# EAGLE schematic NBMC_SCHEMATIC_wout_709 (EAGLE 6.6.0)
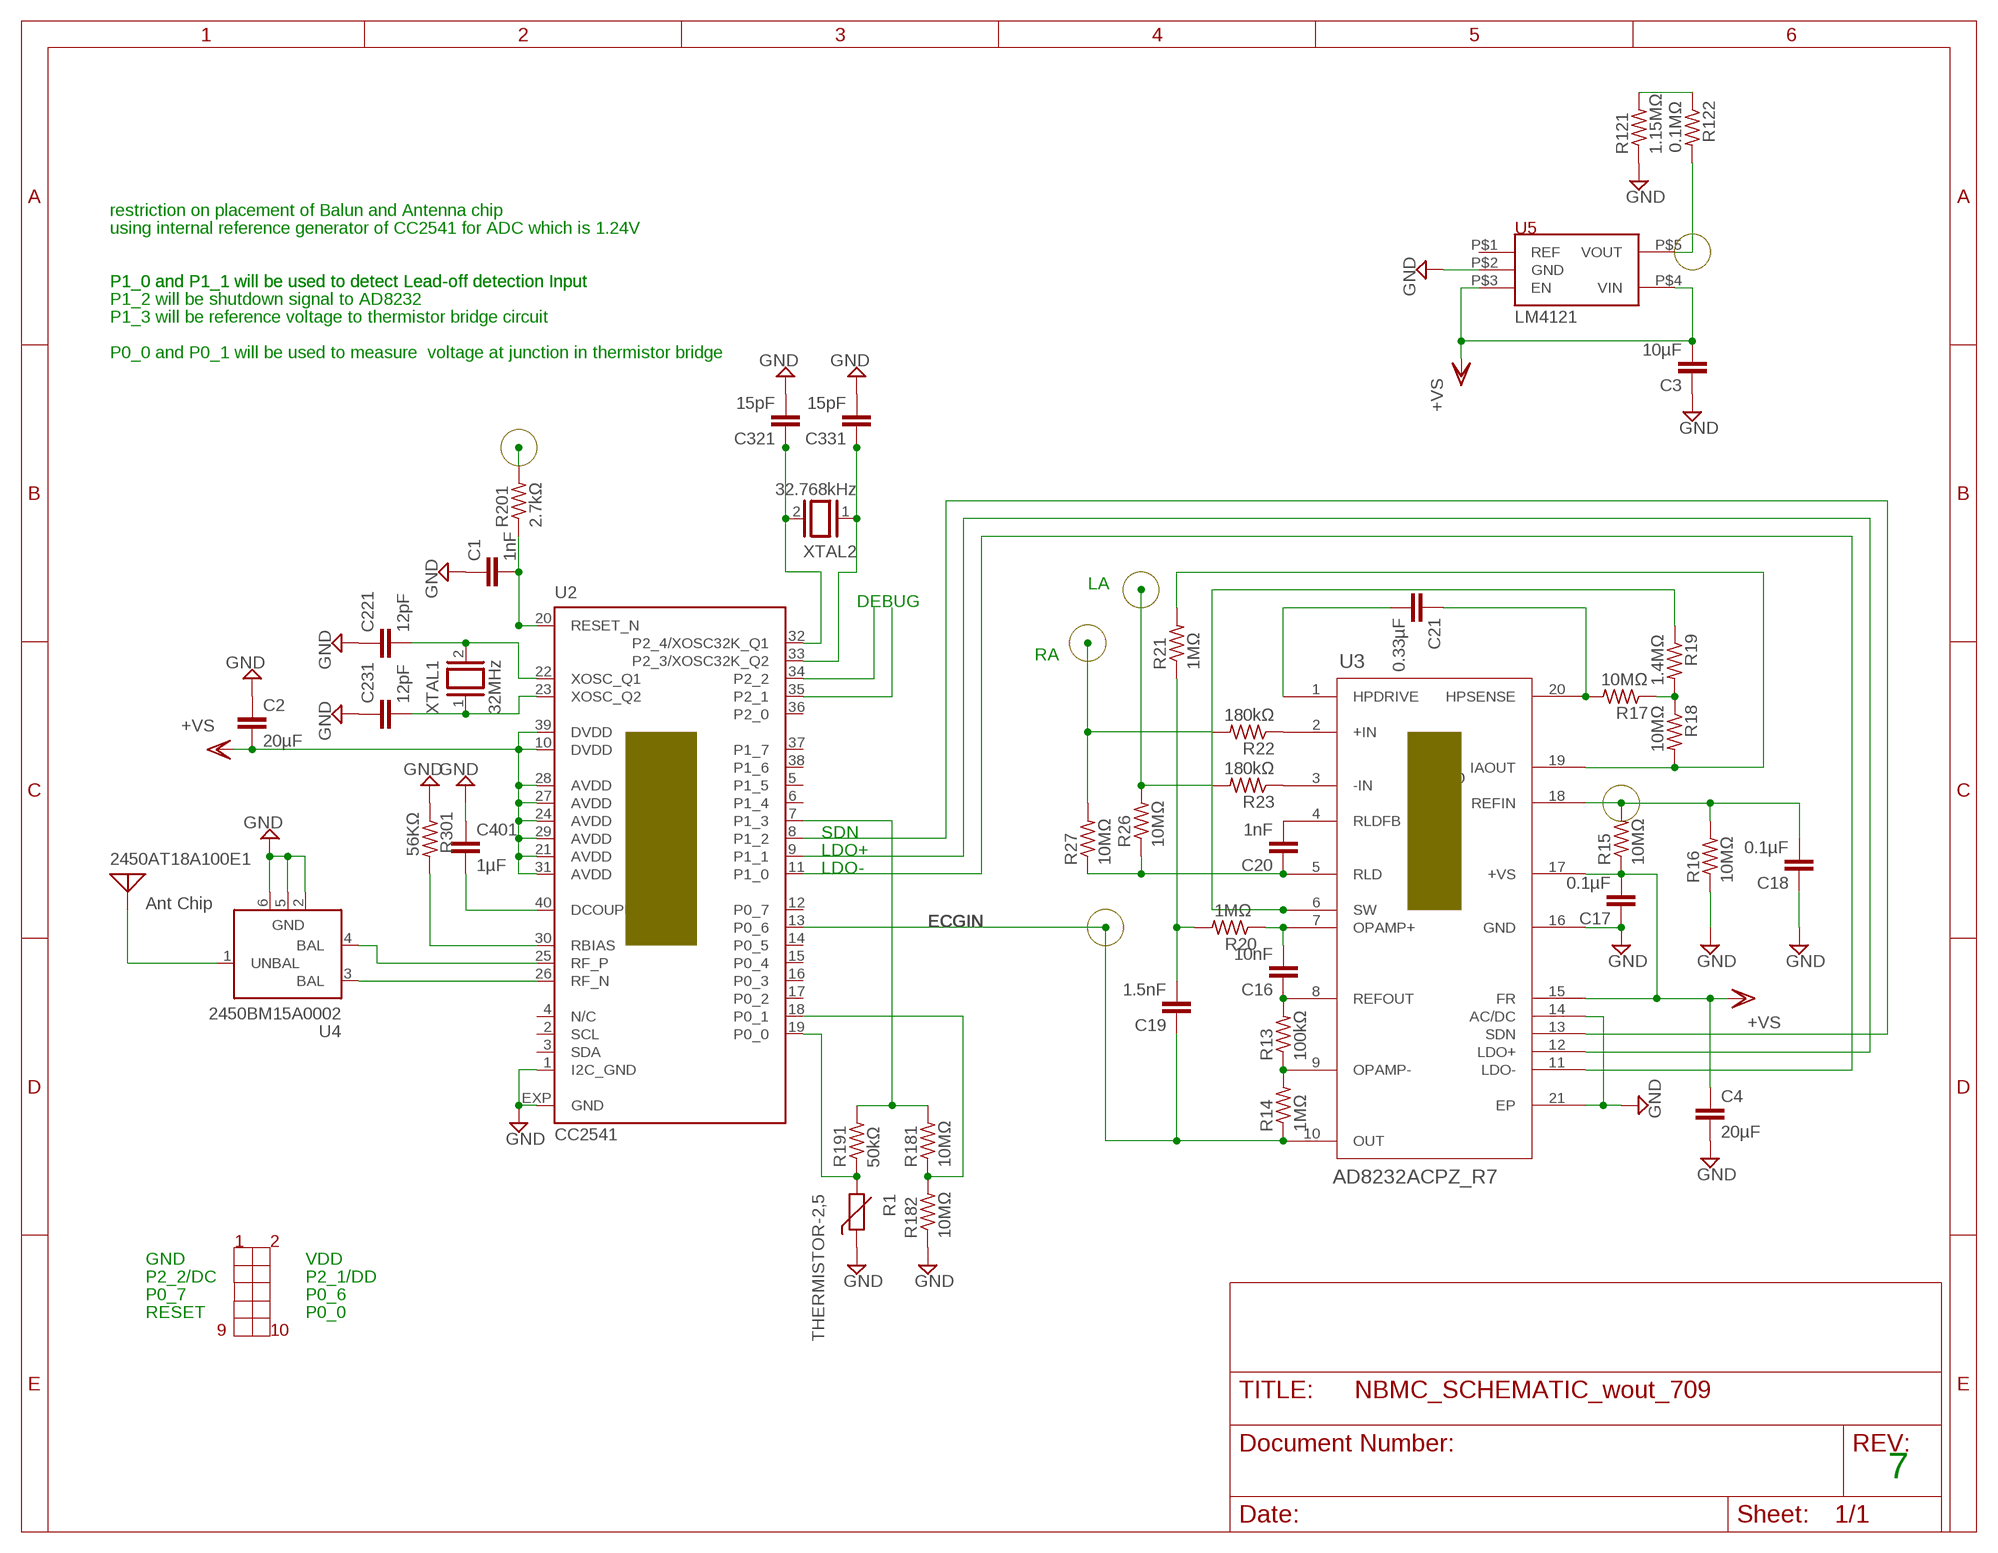
[diagram p0: schematic, sheet 1]

## Parts
2450AT18A100E1  Ant Chip  ANTENNA  [PAD-01]
C1  1nF  C-EUC0402  [C0402]
C2  20µF  C-EUC0402  [C0402]
C3  10µF  C-EUC0402  [C0402]
C4  20µF  C-EUC0402  [C0402]
C16  10nF  C-EUC0402  [C0402]
C17  0.1µF  C-EUC0402  [C0402]
C18  0.1µF  C-EUC0402  [C0402]
C19  1.5nF  C-EUC0402  [C0402]
C20  1nF  C-EUC0402  [C0402]
C21  0.33µF  C-EUC0402  [C0402]
C221  12pF  C-EUC0402  [C0402]
C231  12pF  C-EUC0402  [C0402]
C321  15pF  C-EUC0402  [C0402]
C331  15pF  C-EUC0402  [C0402]
C401  1µF  C-EUC0402  [C0402]
R1  THERMISTOR-2,5  [RS-2,5]
R13  100kΩ  R-US_R0402  [R0402]
R14  1MΩ  R-US_R0402  [R0402]
R15  10MΩ  R-US_R0402  [R0402]
R16  10MΩ  R-US_R0402  [R0402]
R17  10MΩ  R-US_R0402  [R0402]
R18  10MΩ  R-US_R0402  [R0402]
R19  1.4MΩ  R-US_R0402  [R0402]
R20  1MΩ  R-US_R0402  [R0402]
R21  1MΩ  R-US_R0402  [R0402]
R22  180kΩ  R-US_R0402  [R0402]
R23  180kΩ  R-US_R0402  [R0402]
R26  10MΩ  R-US_R0402  [R0402]
R27  10MΩ  R-US_R0402  [R0402]
R121  1.15MΩ  R-US_R0402  [R0402]
R122  0.1MΩ  R-US_R0402  [R0402]
R181  10MΩ  R-US_R0402  [R0402]
R182  10MΩ  R-US_R0402  [R0402]
R191  50kΩ  R-US_R0402  [R0402]
R201  2.7kΩ  R-US_R0402  [R0402]
R301  56KΩ  R-US_R0402  [R0402]
U2  CC2541  [RHA_S-PVQFN-N40]
U3  AD8232ACPZ_R7  [CP_20_10]
U4  2450BM15A0002  [2450BM15A0002]
U5  LM4121  [0402]
XTAL1  32MHz  XTAL  [Q]
XTAL2  32.768kHz  XTAL  [Q]

## Nets
ECGIN: C19.1 R14.1 U2.13(P0_6) U3.10(OUT)
GND: C1.1 C2.1 C3.1 C4.2 C17.1 C18.1 C221.1 C231.1 C321.2 C331.2 C401.1 R1.1 R16.1 R121.1 R182.1 R301.1 U2.1(I2C_GND) U2.EXP(GND) U3.14(AC/DC) U3.16(GND) U3.21(EP) U4.2(GND) U4.5(GND) U4.6(GND) U5.P$2(GND)
N$1: U2.26(RF_N) U4.3(BAL)
N$2: R301.2 U2.30(RBIAS)
N$3: C1.2 R201.1 U2.20(RESET_N)
N$4: U2.25(RF_P) U4.4(BAL)
N$5: R122.2 U5.P$5(VOUT)
N$6: R201.2
N$7: 2450AT18A100E1.1 U4.1(UNBAL)
N$8: C401.2 U2.40(DCOUPL)
N$9: R181.1 R182.2 U2.18(P0_1)
N$10: R1.2 R191.1 U2.19(P0_0)
N$11: C221.2 U2.22(XOSC_Q1) XTAL1.2
N$12: C231.2 U2.23(XOSC_Q2) XTAL1.1
N$13: C321.1 U2.32(P2_4/XOSC32K_Q1) XTAL2.2
N$14: C331.1 U2.33(P2_3/XOSC32K_Q2) XTAL2.1
N$15: R22.1 U3.2(+IN)
N$16: R121.2 R122.1
N$17: C20.1 R26.1 R27.1 U3.5(RLD)
N$18: R181.2 R191.2 U2.7(P1_3)
N$19: U2.35(P2_1)
N$20: U2.34(P2_2)
N$21: R23.1 U3.3(-IN)
N$22: R19.1 U3.6(SW)
N$25: U2.11(P1_0) U3.11(LDO-)
N$26: U2.9(P1_1) U3.12(LDO+)
N$27: U2.8(P1_2) U3.13(SDN)
N$29: C19.2 R20.2 R21.1
N$31: R22.2 R27.2
N$37: R13.1 R14.2 U3.9(OPAMP-)
N$40: R23.2 R26.2
N$41: C16.2 R20.1 U3.7(OPAMP+)
N$42: C16.1 R13.2 U3.8(REFOUT)
N$46: C18.2 R15.2 R16.2 U3.18(REFIN)
N$49: R18.2 R21.2 U3.19(IAOUT)
N$50: C21.1 R17.2 U3.20(HPSENSE)
N$51: R17.1 R18.1 R19.2
N$54: C20.2 U3.4(RLDFB)
N$57: C21.2 U3.1(HPDRIVE)
VSS: C2.2 C3.2 C4.1 C17.2 R15.1 U2.10(DVDD) U2.21(AVDD) U2.24(AVDD) U2.27(AVDD) U2.28(AVDD) U2.29(AVDD) U2.31(AVDD) U2.39(DVDD) U3.15(FR) U3.17(+VS) U5.P$3(EN) U5.P$4(VIN) ; supply symbol labelled +VS
Unconnected: U2.2(SCL) U2.3(SDA) U2.5(P1_5) U2.6(P1_4) U2.12(P0_7) U2.14(P0_5) U2.15(P0_4) U2.16(P0_3) U2.17(P0_2) U2.36(P2_0) U2.37(P1_7) U2.38(P1_6) U5.P$1(REF)

## Notes on the sheet
- restriction on placement of Balun and Antenna chip
- using internal reference generator of CC2541 for ADC which is 1.24V
- P1_0 and P1_1 will be used to detect Lead-off detection Input | P1_0 and P1_1 will be used to detect Lead-off detection Input
- P1_2 will be shutdown signal to AD8232
- P1_3 will be reference voltage to thermistor bridge circuit
- P0_0 and P0_1 will be used to measure  voltage at junction in thermistor bridge
- LA
- DEBUG
- RA
- GND
  PAD
- GND
  PAD
- GND
  PAD
- GND
  PAD
- GND
  PAD
- GND
  PAD
- GND
  PAD
- GND
  PAD
- SDN
- LDO+
- LDO-
- 1 | 2
- GND | VDD
- P2_2/DC | P2_1/DD
- P0_7 | P0_6
- RESET | P0_0
- 9 | 10
- 7

## Power pins joined to a net without a drawn wire
N/C: U2.4(N/C)

## Library data of the parts
2450AT18A100E1 = discrete:ANTENNA: Antenna
C1-C4 C16-C21 C221 C231 C321 C331 C401 = rcl:C-EU: CAPACITOR, European symbol
R1 = varistor:THERMISTOR: THERMISTOR
R13-R23 R26 R27 R121 R122 R181 R182 R191 R201 R301 = rcl:R-US_: RESISTOR, American symbol
U2 = ST-CC254X:CC2541: CC2541 Bluetooth Smart SoC
U3 = AD8232:AD8232ACPZ_R7
U4 = johanson-technology:2450BM15A0002: 2.45 GHz Impedance Matched Balun-Filter For TI CC253X/CC2540 Chipset family Data sheet <http://www.johansontechnology.com/images/stories/ip/baluns/balun_filter_combo_matched_2450bm15a0002_v8.pdf>
U5 = LM4121:LM4121
XTAL1 XTAL2 = special:XTAL: CRYSTAL